# Altium schematic sheet Motor0.SchDoc
size A3; DocumentNumber: 1; SheetNumber: 3; SheetTotal: 5; SPICEModelCache: <root> / <DocumentId>HIQXUUEP</DocumentId> / </root>
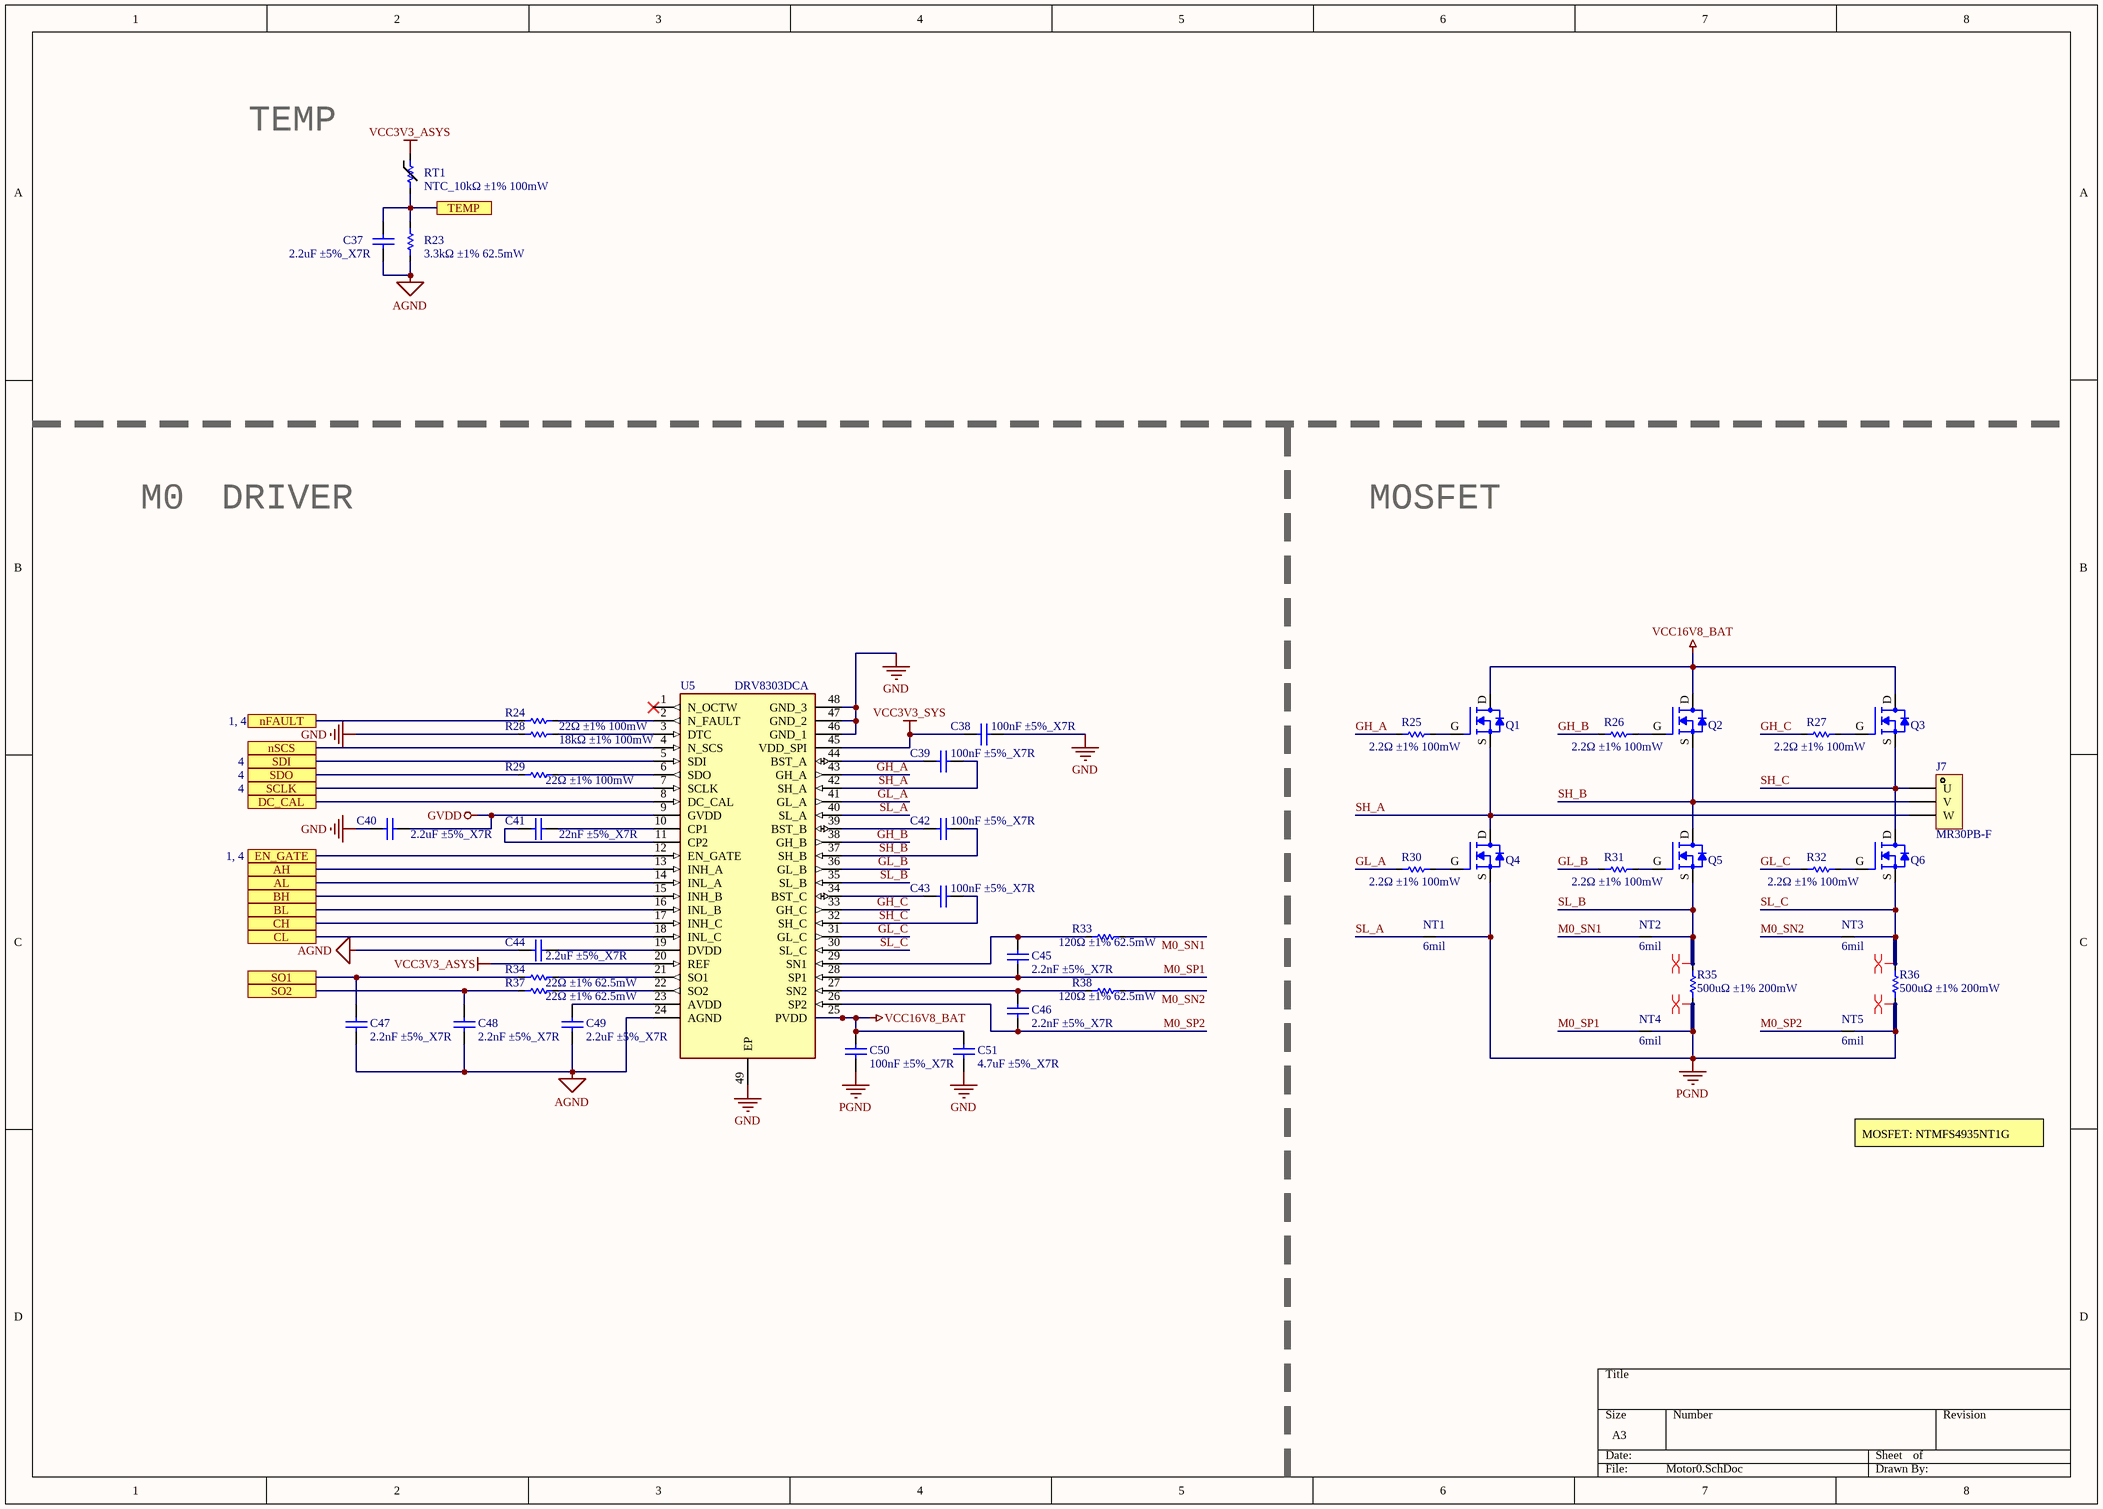
[diagram p0: Motor0.SchDoc]

## Parts
C37  2.2uF ±5%_X7R  [C0402]
C38  100nF ±5%_X7R  [C0402]
C39  100nF ±5%_X7R  [C0402]
C40  2.2uF ±5%_X7R  [C0402]
C41  22nF ±5%_X7R  [C0402]
C42  100nF ±5%_X7R  [C0402]
C43  100nF ±5%_X7R  [C0402]
C44  2.2uF ±5%_X7R  [C0402]
C45  2.2nF ±5%_X7R  [C0402]
C46  2.2nF ±5%_X7R  [C0402]
C47  2.2nF ±5%_X7R  [C0402]
C48  2.2nF ±5%_X7R  [C0402]
C49  2.2uF ±5%_X7R  [C0402]
C50  100nF ±5%_X7R  [C0402]
C51  4.7uF ±5%_X7R  [C0603]
J7  MR30PB-F  [MR30PB-F [Straight] [SMT]]
NT1  6mil  [NETTIE_6mil]  (net tie, no BOM)
NT2  6mil  [NETTIE_6mil]  (net tie, no BOM)
NT3  6mil  [NETTIE_6mil]  (net tie, no BOM)
NT4  6mil  [NETTIE_6mil]  (net tie, no BOM)
NT5  6mil  [NETTIE_6mil]  (net tie, no BOM)
Q1  BSC027N04LSG  [NRVTS10100EMFST1G]  (value not drawn)
Q2  BSC027N04LSG  [NRVTS10100EMFST1G]  (value not drawn)
Q3  BSC027N04LSG  [NRVTS10100EMFST1G]  (value not drawn)
Q4  BSC027N04LSG  [NRVTS10100EMFST1G]  (value not drawn)
Q5  BSC027N04LSG  [NRVTS10100EMFST1G]  (value not drawn)
Q6  BSC027N04LSG  [NRVTS10100EMFST1G]  (value not drawn)
R23  3.3kΩ ±1% 62.5mW  [R0402]
R24  22Ω ±1% 100mW  [R0402]
R25  2.2Ω ±1% 100mW  [R0402]
R26  2.2Ω ±1% 100mW  [R0402]
R27  2.2Ω ±1% 100mW  [R0402]
R28  18kΩ ±1% 100mW  [R0402]
R29  22Ω ±1% 100mW  [R0402]
R30  2.2Ω ±1% 100mW  [R0402]
R31  2.2Ω ±1% 100mW  [R0402]
R32  2.2Ω ±1% 100mW  [R0402]
R33  120Ω ±1% 62.5mW  [R0402]
R34  22Ω ±1% 62.5mW  [R0402]
R35  500uΩ ±1% 200mW  [R2512]
R36  500uΩ ±1% 200mW  [R2512]
R37  22Ω ±1% 62.5mW  [R0402]
R38  120Ω ±1% 62.5mW  [R0402]
RT1  NTC_10kΩ ±1% 100mW  [R0402]
U5  DRV8303DCA  [SOP50P810X120-49N]

## Ports
AH, AL, BH, BL, CH, CL, DC_CAL, EN_GATE (see 1, 4), nFAULT (see 1, 4), nSCS, SCLK (see 4), SDI (see 4), SDO (see 4), SO1, SO2, TEMP

## Nets
AGND: C37.1 C44.2 C47.1 C48.1 C49.1 R23.2 U5.24(AGND)
GND: C38.1 C40.1 C51.1 R28.2 U5.46(GND_1) U5.47(GND_2) U5.48(GND_3) U5.49(EP)
GVDD: C40.2 U5.9(GVDD)
PGND: C50.1 NT1.2 NT4.2 NT5.2 Q4.S R35.1 R36.1
VCC3V3_ASYS: RT1.1 U5.20(REF)
VCC3V3_SYS: C38.2 U5.45(VDD_SPI)
VCC16V8_BAT: C50.2 C51.2 Q1.D Q2.D Q3.D U5.25(PVDD)
AH: U5.13(INH_A) ; port AH
AL: U5.14(INL_A) ; port AL
BH: U5.15(INH_B) ; port BH
BL: U5.16(INL_B) ; port BL
CH: U5.17(INH_C) ; port CH
CL: U5.18(INL_C) ; port CL
DC_CAL: U5.8(DC_CAL) ; port DC_CAL
EN_GATE: U5.12(EN_GATE) ; port EN_GATE
GH_A: R25.1 U5.43(GH_A)
GH_B: R26.1 U5.38(GH_B)
GH_C: R27.1 U5.33(GH_C)
GL_A: R30.1 U5.41(GL_A)
GL_B: R31.1 U5.36(GL_B)
GL_C: R32.1 U5.31(GL_C)
M0_SN1: NT2.1 R33.1
M0_SN2: NT3.1 R38.1
M0_SP1: C45.1 NT4.1 U5.28(SP1)
M0_SP2: C46.1 NT5.1 U5.26(SP2)
nFAULT: R24.1 ; port nFAULT
nSCS: U5.4(N_SCS) ; port nSCS
SCLK: U5.7(SCLK) ; port SCLK
SDI: U5.5(SDI) ; port SDI
SDO: R29.1 ; port SDO
SH_A: C39.1 J7.3(W) Q1.S Q4.D U5.42(SH_A)
SH_B: C42.1 J7.2(V) Q2.S Q5.D U5.37(SH_B)
SH_C: C43.1 J7.1(U) Q3.S Q6.D U5.32(SH_C)
SL_A: NT1.1 U5.40(SL_A)
SL_B: NT2.2 Q5.S R35.2 U5.35(SL_B)
SL_C: NT3.2 Q6.S R36.2 U5.30(SL_C)
SO1: C47.2 R34.2 ; port SO1
SO2: C48.2 R37.2 ; port SO2
TEMP: C37.2 R23.1 RT1.2 ; port TEMP
NetC39_2: C39.2 U5.44(BST_A)
NetC41_1: C41.1 U5.10(CP1)
NetC41_2: C41.2 U5.11(CP2)
NetC42_2: C42.2 U5.39(BST_B)
NetC43_2: C43.2 U5.34(BST_C)
NetC44_1: C44.1 U5.19(DVDD)
NetC45_2: C45.2 R33.2 U5.29(SN1)
NetC46_2: C46.2 R38.2 U5.27(SN2)
NetC49_2: C49.2 U5.23(AVDD)
NetQ1_G: Q1.G R25.2
NetQ2_G: Q2.G R26.2
NetQ3_G: Q3.G R27.2
NetQ4_G: Q4.G R30.2
NetQ5_G: Q5.G R31.2
NetQ6_G: Q6.G R32.2
NetR24_2: R24.2 U5.2(N_FAULT)
NetR28_1: R28.1 U5.3(DTC)
NetR29_2: R29.2 U5.6(SDO)
NetR34_1: R34.1 U5.21(SO1)
NetR37_1: R37.1 U5.22(SO2)

Not connected (* = marked no-connect by the designer): U5 1(N_OCTW)*

## Notes on the sheet
- TEMP
- M0
- DRIVER
- MOSFET
- MOSFET: NTMFS4935NT1G

## Library data of the parts
C37-C39 C41-C43 C45-C48 C50 C51 = Cap: Capacitor; Published: 8-Jun-2000; LatestRevisionDate: 17-Jul-2002; LatestRevisionNote: Re-released for DXP Platform.; PackageReference: RAD-0.3; Publisher: Altium Limited; PackageDescription: Radial Cap, Thru-Hole; 2 Leads; 0.3 in Pin Spacing
C40 C44 C49 = Cap: CL05A225KO5NQNC; Published: 8-Jun-2000; LatestRevisionDate: 17-Jul-2002; LatestRevisionNote: Re-released for DXP Platform.; PackageReference: RAD-0.3; Publisher: Altium Limited; PackageDescription: Radial Cap, Thru-Hole; 2 Leads; 0.3 in Pin Spacing
J7 = MR30PB-F [Straight] [SMT]: 驱动器端
NT1-NT5 = NETTIE
Q1-Q6 = MOSFET-N: MOSFET – Power, Single, / N-Channel, PG-TDSON-8 / SuperSO8 5x6 / 40 V, 139 A; Manufacturer: ON Semiconductor; Manufacturer Part Number: NTMFS4935NT1G; Drain to Source Voltage (Vdss): 30V; Current - Continuous Drain (Id) @ 25°C: 13A (Ta), 93A (Tc); Drive Voltage (Max Rds On,  Min Rds On): 4.5V, 10V; Vgs(th) (Max) @ Id: 2.2V @ 250µA; Gate Charge (Qg) (Max) @ Vgs: 49.4nC @ 10V; Input Capacitance (Ciss) (Max) @ Vds: 4850pF @ 15V; Vgs (Max): ±20V; Power Dissipation (Max): 930mW (Ta), 48W (Tc); Rds On (Max) @ Id, Vgs: 3.2 mOhm @ 30A, 10V; Supplier 1: Digi-Key; Supplier Part Number 1: NTMFS4935NT1GOSCT-ND; RoHS: RoHS Compliant; Category: Discrete Semiconductor Products; Stock 1: 932; Pricing 1: 1=0.61, 10=0.541, 100=0.4145, 500=0.3277 (USD); Packaging: Cut Tape (CT); Part Status: Active; FET Type: N-Channel; Technology: MOSFET (Metal Oxide); FET Feature: -; Operating Temperature: -55°C ~ 150°C (TJ); Mounting Type: Surface Mount; Supplier Device Package: 5-DFN (5x6) (8-SOFL); Package / Case: 8-PowerTDFN, 5 Leads; ComponentLink1URL: http://www.onsemi.com/pub_link/Collateral/NTMFS4935N-D.PDF; ComponentLink1Description: http://www.onsemi.com/pub_link/Collateral/NTMFS4935N-D.PDF
R23-R38 = Res: Resistor; Published: 8-Jun-2000; LatestRevisionDate: 17-Jul-2002; LatestRevisionNote: Re-released for DXP Platform.; PackageReference: AXIAL-0.3; Publisher: Altium Limited; PackageDescription: Axial Device, Thru-Hole; 2 Leads; 0.3 in Pin Spacing
RT1 = TEMP RES: THERMISTOR 10K OHM NTC 0402 SMD
U5 = DRV8303DCA: Integrated Circuit; Manufacturer_Name: Texas Instruments; Datasheet Link: https://componentsearchengine.com/Datasheets/2/DRV8303DCA.pdf; Height: 1.2mm; Manufacturer_Part_Number: DRV8303DCA; Mouser Part Number: 595-DRV8303DCA; Mouser Price/Stock: https://www.mouser.co.uk/ProductDetail/Texas-Instruments/DRV8303DCA?qs=igp4D3uu33KLowzNFy6WPA%3D%3D; Arrow Part Number: DRV8303DCA; Arrow Price/Stock: https://www.arrow.com/en/products/drv8303dca/texas-instruments